# Altium schematic sheet Power Distribution.SchDoc
size A; SheetNumber: 3; SheetTotal: 3
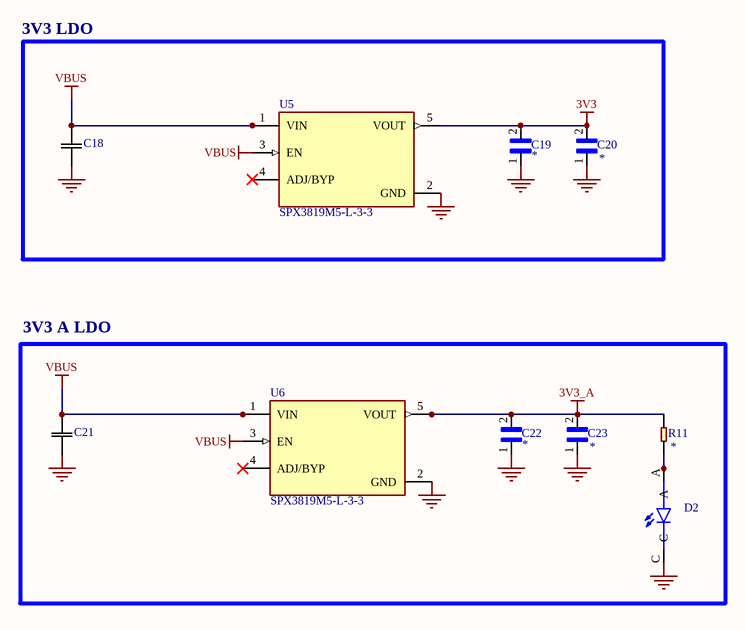
[diagram p0: Power Distribution.SchDoc]

## Parts
C18  CC0201MRX5R6BB105  [CAP_CC0201_YAG]  (value not drawn)
C19  GRM033R71A103KA01D  [CAPC0603X33N]  (value not drawn)
C20  GRM155C80J225KE95D  [CAPC1005X55N]  (value not drawn)
C21  CC0201MRX5R6BB105  [CAP_CC0201_YAG]  (value not drawn)
C22  GRM033R71A103KA01D  [CAPC0603X33N]  (value not drawn)
C23  GRM155C80J225KE95D  [CAPC1005X55N]  (value not drawn)
D2  LTST-C190KFKT  [LEDM1608X80]  (value not drawn)
R11  SMD-RES-1K-5%-1/16W(0402)  [R0402]  (value not drawn)
U5  SPX3819M5-L-3-3  [SOT95P280X145-5N]
U6  SPX3819M5-L-3-3  [SOT95P280X145-5N]

## Blocks framed on the sheet
3V3 LDO: C18-C20 U5
3V3 A LDO: C21-C23 D2 R11 U6

## Nets
3V3: C19.2 C20.2 U5.5(VOUT)
3V3_A: C22.2 C23.2 R11.2 U6.5(VOUT)
GND: C18.1 C19.1 C20.1 C21.1 C22.1 C23.1 D2.C U5.2(GND) U6.2(GND)
VBUS: C18.2 C21.2 U5.1(VIN) U5.3(EN) U6.1(VIN) U6.3(EN)
NetD2_A: D2.A R11.1

Not connected (* = marked no-connect by the designer): U5 4(ADJ/BYP)*; U6 4(ADJ/BYP)*

## Library data of the parts
C18 C21 = CC0201MRX5R6BB105: No Description Available; Mfr_Name: Yageo
C19 C22 = GRM033R71A103KA01D: SMD Capacitor X7R(EIA) with Capacitance: 10000pF Tol. 10%. Rated Voltage: 10Vdc; MF: Murata; MP: GRM033R71A103KA01D; Availability: Unavailable; SnapEDA_Link: https://www.snapeda.com/parts/GRM033R71A103KA01D/Murata/view-part/4379446/?ref=snap; Value: *; Check_prices: https://www.snapeda.com/parts/GRM033R71A103KA01D/Murata/view-part/4379446/?ref=eda; Package: 0603 Taiyo Yuden; Price: None
C20 C23 = GRM155C80J225KE95D: 2.2ÂµF Â±10% 6.3V Ceramic Capacitor X6S 0402 (1005 Metric); MF: Murata; Digi-Key_Part_Number: 490-10012-1-ND; Check_prices: https://www.snapeda.com/parts/GRM155C80J225KE95D/Murata%20Electronics%20North%20America/view-part/1764715/?ref=eda; MP: GRM155C80J225KE95D; Value: *; SnapEDA_Link: https://www.snapeda.com/parts/GRM155C80J225KE95D/Murata%20Electronics%20North%20America/view-part/1764715/?ref=snap; Package: 1005 Taiyo Yuden; Purchase-URL: https://pricing.snapeda.com/search/part/GRM155C80J225KE95D/?ref=eda
D2 = LTST-C190KFKT: LED Uni-Color Orange 611nm 2-Pin Chip LED T/R; MF: Lite-On Electronics; Price: None; MP: LTST-C190KFKT; Purchase-URL: https://pricing.snapeda.com/search/part/LTST-C190KFKT/?ref=eda; Package: 0603 Lite-On; Check_prices: https://www.snapeda.com/parts/LTST-C190KFKT/Applied+Avionics/view-part/?ref=eda; SnapEDA_Link: https://www.snapeda.com/parts/LTST-C190KFKT/Applied+Avionics/view-part/?ref=snap; Value: *; Availability: In Stock
R11 = SMD-RES-1K-5%-1/16W(0402): 1 kOhms Â±5% 0.063W, 1/16W Chip Resistor 0402 (1005 Metric) Moisture Resistant Thick Film; MP: RC0402JR-071KL; MF: Yageo; Check_prices: https://www.snapeda.com/parts/RC0402JR-071KL/Yageo/view-part/?ref=eda; Value: *; Purchase-URL: https://pricing.snapeda.com/search/part/RC0402JR-071KL/?ref=eda; SnapEDA_Link: https://www.snapeda.com/parts/RC0402JR-071KL/Yageo/view-part/?ref=snap; Package: 0402 Yageo; Digi-Key_Part_Number: 311-1.0KJRTR-ND
U5 U6 = SPX3819M5-L-3-3: Linear Voltage Regulator IC Positive Fixed 1 Output 500mA SOT-23-5; MF: MaxLinear, Inc.; MP: SPX3819M5-L-3-3/TR; SnapEDA_Link: https://www.snapeda.com/parts/SPX3819M5-L-3-3/TR/MaxLinear%252C+Inc./view-part/?ref=snap; Package: SOT-23-5 Exar; Value: *; Check_prices: https://www.snapeda.com/parts/SPX3819M5-L-3-3/TR/MaxLinear%252C+Inc./view-part/?ref=eda